# Altium project pca10156.PrjPCB
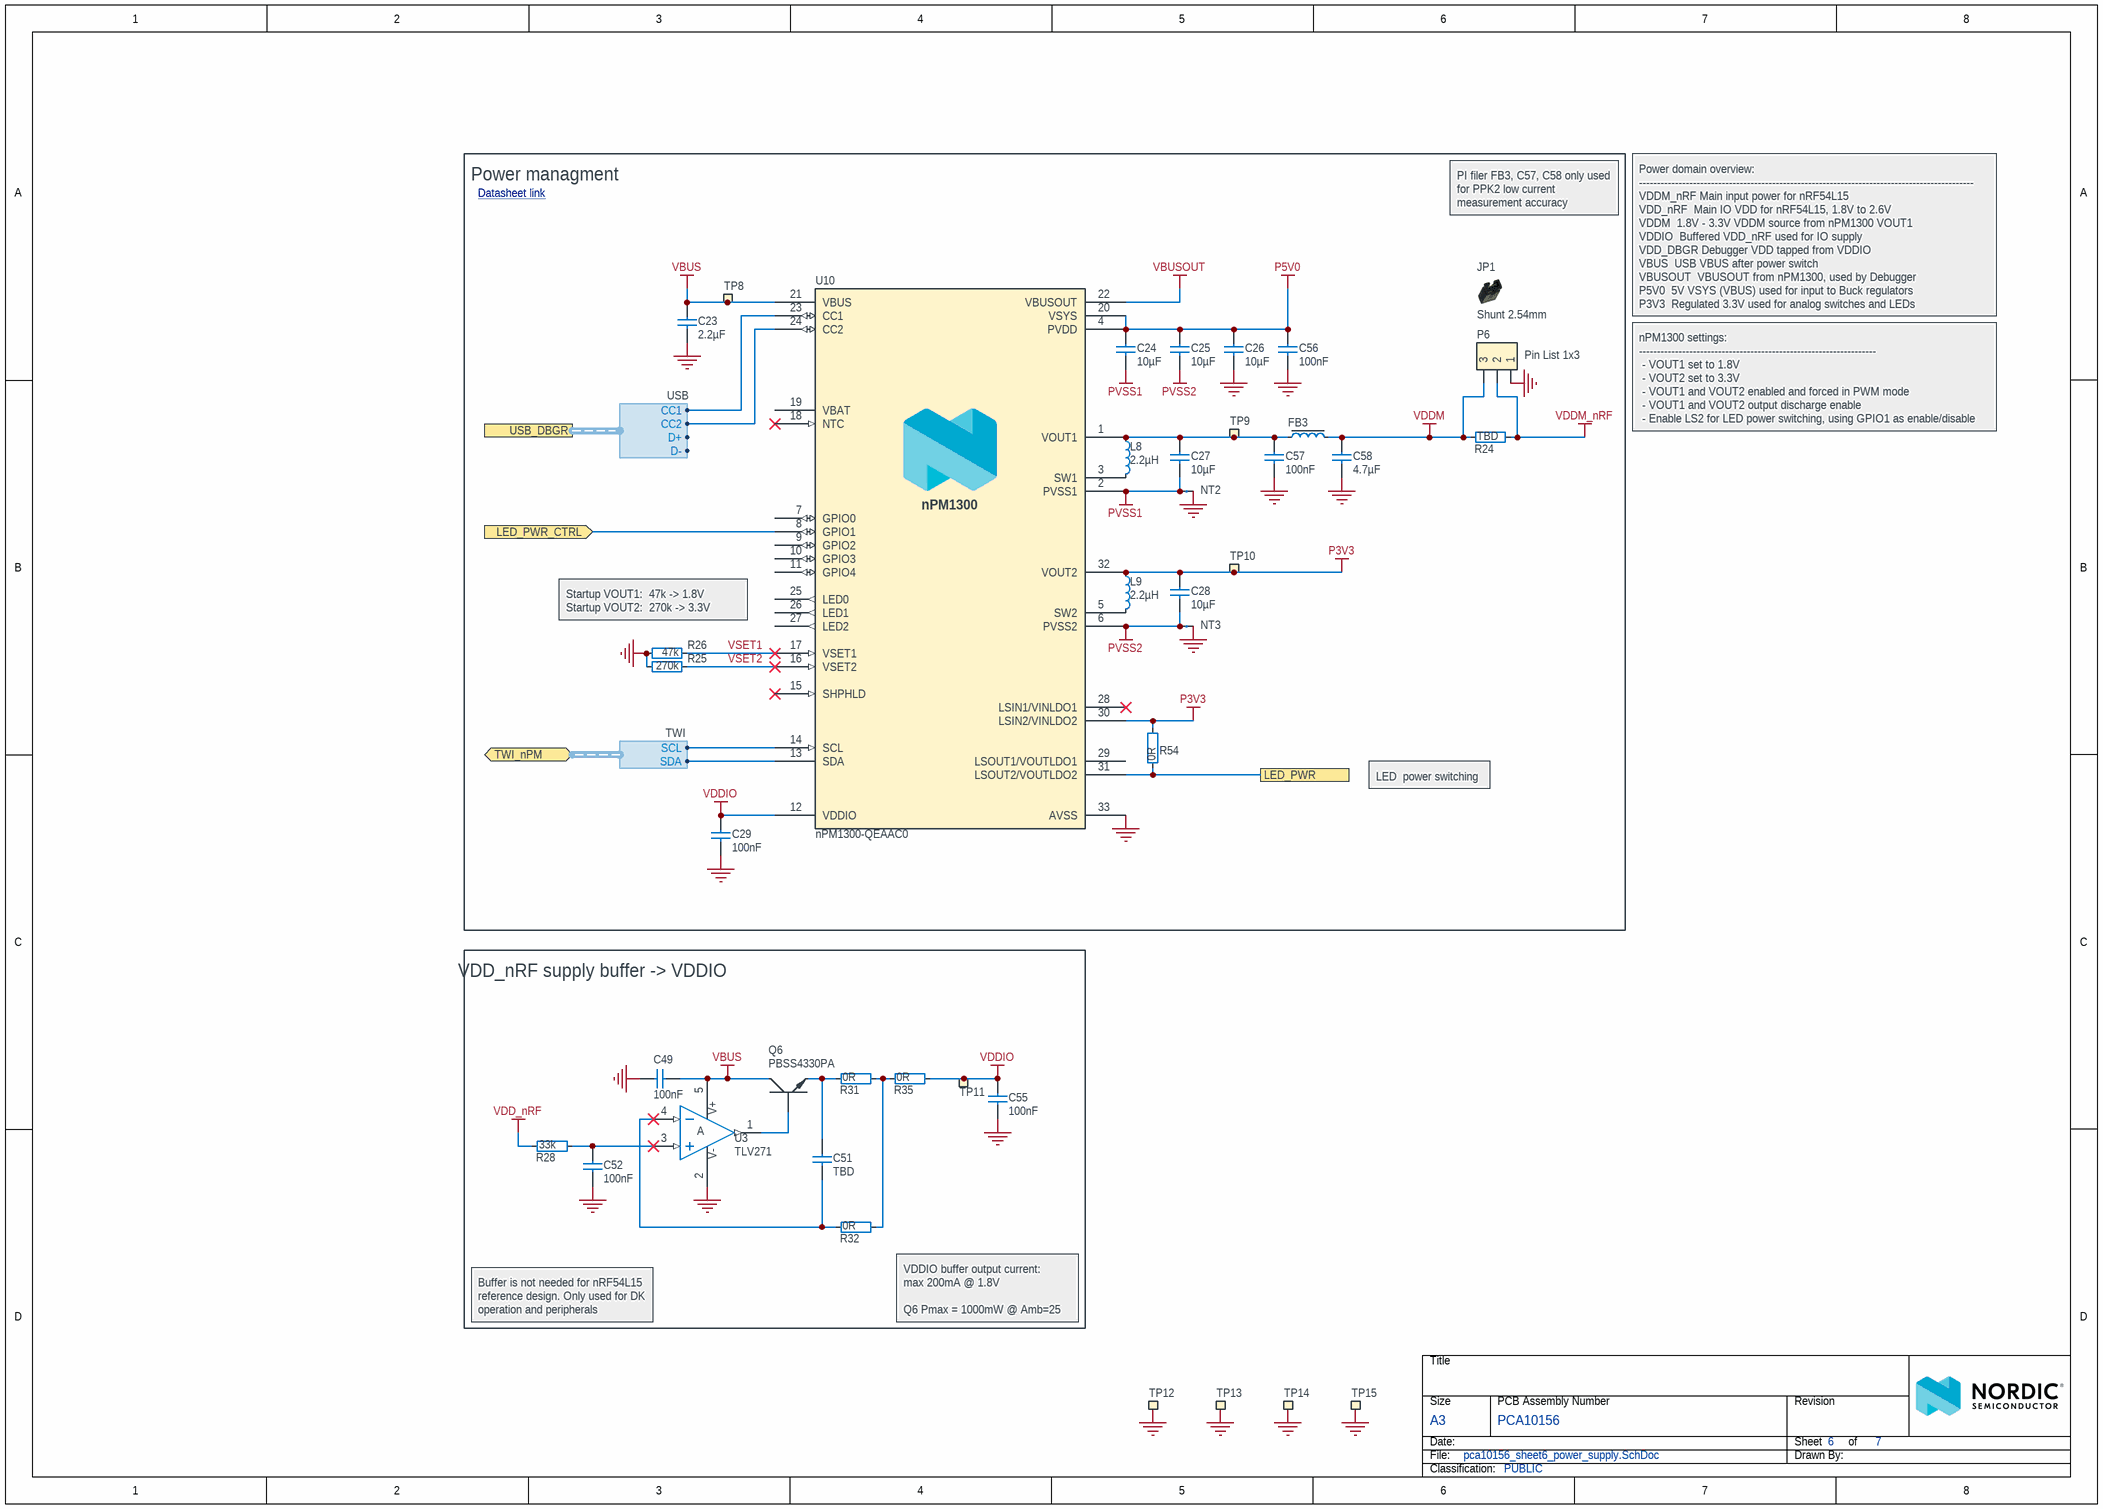
[diagram p0: pca10156_sheet6_power_supply.SchDoc]
SurfaceFinish: ENIG Gold; SoldermaskColor: Blue; SilkscreenColor: White; ProductName: nRF54L15-DK; PCBStackup: 4001; PCBRevision: 0032STL1; PCBNumber: 400708; PCARevision: 0.9.1; PCAName: PCA10156; Organization: Nordic Semiconductor; NrOfLayers: 4; Dielectric: FR-4; Designer: STL1; Compliance: RoHS, REACH, Halogen-Free; Classification: PUBLIC; BoardTitle: nRF54L15-DK; BoardThickness: 1.6mm
2 sheets, 65 parts. Net scope: flat (ports and power ports of the same name join across sheets).
Board files: 400708.PcbDoc, 400708 _panel.PcbDoc
Sheets:
  pca10156_sheet6_power_supply.SchDoc
  pca10156_sheet7_connectors.SchDoc

## Sheet pca10156_sheet6_power_supply.SchDoc: =BoardTitle+' - Power Supply'
size A3; Organization: Nordic Semiconductor; DocumentNumber: 6; Revision: 0.9.1; SheetNumber: 6; SheetTotal: 7; Author: STL1; CompanyName: Nordic Semiconductor; DrawnBy: STL1; DocumentSize: A4

### Parts
C23  2.2µF  [CAPC1005X04L]
C24  10µF  [CAPC1608X06L]
C25  10µF  [CAPC1608X06L]
C26  10µF  [CAPC1608X06L]
C27  10µF  [CAPC1608X06L]
C28  10µF  [CAPC1608X06L]
C29  100nF  [CAPC0603X03L_C]
C49  100nF  [CAPC0603X03L_C]
C51  TBD  [CAPC0603X03L_C]
C52  100nF  [CAPC0603X03L_C]
C55  100nF  [CAPC0603X03L_C]
C56  100nF  [CAPC0603X03L_C]
C57  100nF  [CAPC0603X03L_C]
C58  4.7µF  [CAPC1608X06L]
FB3  120R/0.55A  [INDC1005X04L]  (value not drawn)
JP1  Shunt 2.54mm  [Shunt_2.54mm_Vertical]
L8  2.2µH  [INDC2016X10N]
L9  2.2µH  [INDC2016X10N]
NT2  Net tie  [2 PIN STARPOINT]  (value not drawn)  (net tie, no BOM)
NT3  Net tie  [2 PIN STARPOINT]  (value not drawn)  (net tie, no BOM)
P6  Pin List 1x3  [LIST_1x3_SMD]
Q6  PBSS4330PA  [DFN105P200X65-3N_v2]
R24  TBD  [RESC1005X04L]
R25  270k  [RESC0603X03L_C]
R26  47k  [RESC0603X03L_C]
R28  33k  [RESC0603X03L_C]
R31  0R  [RESC0603X03L_C]
R32  0R  [RESC0603X03L_C]
R35  0R  [RESC0603X03L_C]
R54  0R  [RESC0603X03L_C]
TP8  Ø1.5mm,SMD  [TP_SMD_D1.5mm]  (value not drawn)  (no BOM)
TP9  Ø1.5mm,SMD  [TP_SMD_D1.5mm]  (value not drawn)  (no BOM)
TP10  Ø1.5mm,SMD  [TP_SMD_D1.5mm]  (value not drawn)  (no BOM)
TP11  Ø1.5mm,SMD  [TP_SMD_D1.5mm]  (value not drawn)  (no BOM)
TP12  Ø1.5mm,SMD  [TP_SMD_D1.5mm]  (value not drawn)  (no BOM)
TP13  Ø1.5mm,SMD  [TP_SMD_D1.5mm]  (value not drawn)  (no BOM)
TP14  Ø1.5mm,SMD  [TP_SMD_D1.5mm]  (value not drawn)  (no BOM)
TP15  Ø1.5mm,SMD  [TP_SMD_D1.5mm]  (value not drawn)  (no BOM)
U3  TLV271  [SOT95P280X145-5N]
U10  nPM1300-QEAAC0  [Nordic_QFN50P500X500X90-33N]

### Blocks framed on the sheet
Power managment: C23-C29 C56-C58 FB3 JP1 L8 L9 NT2 NT3 P6 R24-R26 R54 TP8-TP10 U10
VDD_nRF supply buffer -> VDDIO: C49 C51 C52 C55 Q6 R28 R31 R32 R35 TP11 U3

### Ports
LED_PWR, LED_PWR_CTRL (in), TWI_nPM (bidir, harness TWI), USB_DBGR (harness USB)

### Harnesses
TWI: SDA, SCL
USB: D+, D-, CC1, CC2

### Nets
GND: C23.1 C26.1 C29.2 C49.2 C52.2 C55.2 C56.1 C57.1 C58.2 NT2.1 NT3.1 P6.1 R25.2 R26.2 TP12.1 TP13.1 TP14.1 TP15.1 U3.2(VSS) U10.33(AVSS)
P3V3: C28.2 L9.1 R54.2 TP10.1 U10.30(LSIN2/VINLDO2) U10.32(VOUT2)
P5V0: C24.2 C25.2 C26.2 C56.2 U10.4(PVDD) U10.20(VSYS)
PVSS1: C24.1 C27.1 NT2.2 U10.2(PVSS1)
PVSS2: C25.1 C28.1 NT3.2 U10.6(PVSS2)
VBUS: C23.2 C49.1 Q6.3(C) TP8.1 U3.5(VDD) U10.21(VBUS)
VBUSOUT: U10.22(VBUSOUT)
VDD_nRF: R28.1
VDDIO: C29.1 C55.1 R35.2 TP11.1 U10.12(VDDIO)
VDDM: C58.1 FB3.2 P6.3 R24.2
VDDM_nRF: P6.2 R24.1
VSET1: R26.1 U10.17(VSET1)
VSET2: R25.1 U10.16(VSET2)
NetC27_2: C27.2 C57.2 FB3.1 L8.1 TP9.1 U10.1(VOUT1)
NetC51_1: C51.1 R32.1 U3.4(IN-)
NetC51_2: C51.2 Q6.2(E) R31.1
NetC52_1: C52.1 R28.2 U3.3(IN+)
NetJ3_A5: U10.23(CC1) ; port USB_DBGR.CC1
NetJ3_B5: U10.24(CC2) ; port USB_DBGR.CC2
NetL8_2: L8.2 U10.3(SW1)
NetL9_2: L9.2 U10.5(SW2)
NetQ6_1: Q6.1(B) U3.1(OUT)
NetR31_2: R31.2 R32.2 R35.1
NetR54_1: R54.1 U10.31(LSOUT2/VOUTLDO2) ; port LED_PWR
NetU10_8: U10.8(GPIO1) ; port LED_PWR_CTRL
NetU10_13: U10.13(SDA) ; port TWI_nPM.SDA
NetU10_14: U10.14(SCL) ; port TWI_nPM.SCL

Not connected (* = marked no-connect by the designer): U10 7(GPIO0) 9(GPIO2) 10(GPIO3) 11(GPIO4) 15(SHPHLD)* 18(NTC)* 19(VBAT) 25(LED0) 26(LED1) 27(LED2) 28(LSIN1/VINLDO1)* 29(LSOUT1/VOUTLDO1)

### Notes on the sheet
- Datasheet link <https://infocenter.nordicsemi.com/index.jsp?topic=%2Fstruct_pmic%2Fstruct%2Fnpm1300.html>
- PI filer FB3, C57, C58 only used for PPK2 low current measurement accuracy
- Power domain overview:
  ---------------------------------------------------------------------------------------------
  VDDM_nRF	Main input power for nRF54L15
  VDD_nRF		Main IO VDD for nRF54L15, 1.8V to 2.6V
  VDDM		1.8V - 3.3V VDDM source from nPM1300 VOUT1
  VDDIO		Buffered VDD_nRF used for IO supply
  VDD_DBGR	Debugger VDD tapped from VDDIO
  VBUS		USB VBUS after power switch
  VBUSOUT		VBUSOUT from nPM1300, used by Debugger
  P5V0		5V VSYS (VBUS) used for input to Buck regulators
  P3V3		Regulated 3.3V used for analog switches and LEDs
- nPM1300 settings:
  ------------------------------------------------------------------
  - VOUT1 set to 1.8V
  - VOUT2 set to 3.3V
  - VOUT1 and VOUT2 enabled and forced in PWM mode
  - VOUT1 and VOUT2 output discharge enable
  - Enable LS2 for LED power switching, using GPIO1 as enable/disable signal.
- Startup VOUT1:  47k -> 1.8V
  Startup VOUT2:  270k -> 3.3V
- LED  power switching
- Buffer is not needed for nRF54L15 reference design. Only used for DK operation and peripherals
- (near R32) VDDIO buffer output current:
  max 200mA @ 1.8V
  Q6 Pmax = 1000mW @ Amb=25
- Title
- Size
- Date:
- File:
- A3
- PCB Assembly Number
- Sheet
- Drawn By:
- Revision
- of
- Classification:
- (in symbol nPM1300-QEAAC0) nPM1300
- (in symbol TLV271CW5-7) V+; A; V-

### Library data of the parts
C23 = C0402-2µ2-10V: Capacitor, X5R, ±10%; Manufacturer: N.A.; Part number NEMS: 100200376; Component Status: Active; Pad Count: 2; Note: 10V; Part Number: C0402-2µ2-10V; PartId: 100200376; Component Class: Capacitors; Author: rsk; Manufacturer Part Number: N.A.; ComponentLink1URL: N.A.; ComponentLink1Description: Datasheet; ComponentLink2URL: N.A.; ComponentLink2Description: Supplier link; HelpURL: N.A.; LatestRevisionDate: 2020-10-13; Published: 2016-08-22; Footprint Doc: 0402; Value: 2.2µF; Supplier 1: Digi-Key; Supplier Part Number 1: 490-10451-1-ND; Supplier 2: N.A.; Supplier Part Number 2: N.A.; Artikkelnr Noca: N.A.; Part number IPS: N.A.; Part number Norautron: N.A.
C24-C28 = C0603-10µ-10V-X7T-GRM188D71A106MA73: Capacitor, X7T, ±20%, 10V; Manufacturer: Murata; Part number IPS: 00000004696; Part number NEMS: 100200414; Component Status: Active; Pad Count: 2; Note: 10VDC; Artikkelnr Noca: N.A.; Part Number: C0603-10µ-10V-X7T-GRM188D71A106MA73; PartId: 100200414; Component Class: Capacitors; Author: rsk; Manufacturer Part Number: GRM188D71A106MA73; ComponentLink1URL: N.A.; ComponentLink1Description: Datasheet; ComponentLink2URL: N.A.; ComponentLink2Description: Supplier link; HelpURL: https://no.mouser.com/datasheet/2/281/murata_03052018_GRM_Series_1-1310166.pdf; LatestRevisionDate: 2021-07-22; Published: 2018-09-11; Footprint Doc: 0603; Value: 10µF; Supplier 1: Digi-Key; Supplier Part Number 1: 490-7200-1-ND; Supplier 2: Mouser; Supplier Part Number 2: 81-GRM188D71A106MA3D; Part number Norautron: N.A.
C29 C49 C52 C55 = C0201-100n: Capacitor, X5R, ±10%; Manufacturer: N.A.; Part number IPS: 00000001248, 00000002505; Part number Norautron: 262071862; Part number NEMS: 100200078; Pad Count: 2; Note: 16V; Component Status: Active; Part Number: C0201-100n; Value: 100nF; Footprint Doc: 0201; Component Class: Capacitors; Author: rsk; PartId: 100200078; Manufacturer Part Number: N.A.; ComponentLink1URL: N.A.; ComponentLink1Description: Datasheet; ComponentLink2URL: N.A.; ComponentLink2Description: Supplier link; HelpURL: N.A.; LatestRevisionDate: 2017-11-09; Published: 2014-11-13; Supplier 1: N.A.; Supplier Part Number 1: N.A.; Supplier 2: N.A.; Supplier Part Number 2: N.A.; Artikkelnr Noca: N.A.
C51 = C0201-TBD: Chip Cap 0201; Manufacturer: N.A.; Part number NEMS: 100200002; Component Status: Active; Pad Count: 2; Assembly: Not Mounted; Part Number: C0201-TBD; PartId: 100200002; Component Class: Capacitors; Author: rsk; Manufacturer Part Number: N.A.; ComponentLink1URL: N.A.; ComponentLink1Description: Datasheet; ComponentLink2URL: N.A.; ComponentLink2Description: Supplier link; HelpURL: N.A.; LatestRevisionDate: 2014-11-13; Published: 2014-11-13; Footprint Doc: 0201; Value: TBD; Note: Chip Cap; Supplier 1: N.A.; Supplier Part Number 1: N.A.; Supplier 2: N.A.; Supplier Part Number 2: N.A.; Artikkelnr Noca: N.A.; Part number IPS: N.A.; Part number Norautron: N.A.
C56 = C0201-100n: Capacitor, X5R, ±10%; Manufacturer: N.A.; Part number IPS: 00000001248, 00000002505; Part number Norautron: 262071862; Part number NEMS: 100200078; Note: 16V; Assembly: Not Mounted; Pad Count: 2; Component Status: Active; Part Number: C0201-100n; Manufacturer Part Number: N.A.; LatestRevisionDate: 2017-11-09; Published: 2014-11-13; Value: 100nF; Artikkelnr Noca: N.A.; Footprint Doc: 0201; ComponentLink1URL: N.A.; ComponentLink1Description: Datasheet; ComponentLink2URL: N.A.; ComponentLink2Description: Supplier link; HelpURL: N.A.; Supplier 1: N.A.; Supplier Part Number 1: N.A.; Supplier 2: N.A.; Supplier Part Number 2: N.A.; Component Class: Capacitors; PartId: 100200078; Author: rsk
C57 = C0201-100n: Capacitor, X5R, ±10%; Manufacturer: N.A.; Part number IPS: 00000001248, 00000002505; Part number Norautron: 262071862; Part number NEMS: 100200078; Note: 16V; Pad Count: 2; Component Status: Active; Part Number: C0201-100n; Manufacturer Part Number: N.A.; LatestRevisionDate: 2017-11-09; Published: 2014-11-13; Value: 100nF; Artikkelnr Noca: N.A.; Footprint Doc: 0201; ComponentLink1URL: N.A.; ComponentLink1Description: Datasheet; ComponentLink2URL: N.A.; ComponentLink2Description: Supplier link; HelpURL: N.A.; Supplier 1: N.A.; Supplier Part Number 1: N.A.; Supplier 2: N.A.; Supplier Part Number 2: N.A.; Component Class: Capacitors; PartId: 100200078; Author: rsk
C58 = C0603-4µ7-10V-X7S: Capacitor, X7S, ±10%, 10V; Manufacturer: N.A.; Part number IPS: 00000001779; Part number NEMS: 100200351; Pad Count: 2; Artikkelnr Noca: 20030013; Component Status: Active; Part Number: C0603-4µ7-10V-X7S; Value: 4.7µF; Footprint Doc: 0603; Component Class: Capacitors; Author: rsk; PartId: 100200351; Manufacturer Part Number: N.A.; ComponentLink1URL: N.A.; ComponentLink1Description: Datasheet; ComponentLink2URL: N.A.; ComponentLink2Description: Supplier link; HelpURL: N.A.; LatestRevisionDate: 2016-08-15; Published: 2016-08-15; Note: 10V; Supplier 1: Digi-Key; Supplier Part Number 1: 445-14258-1-ND; Supplier 2: N.A.; Supplier Part Number 2: N.A.; Part number Norautron: N.A.
FB3 = FB0402-120R@100M-500mA: Ferrite Bead, 120 Ohm @ 100MHz, 500mA, 250 mOhm Max; Manufacturer: Murata; Manufacturer Part Number: BLM15AG121SN1D; Part number IPS: 00000009954; Part number Norautron: 265230631; Part number NEMS: 100300099; Note: Chip EMIFIL Inductor Type Chip Ferrite Bead; Artikkelnr Noca: 33029317; Pad Count: 2; Component Status: Active; Part Number: FB0402-120R@100M-500mA; Footprint Doc: 0402; LatestRevisionDate: 2014-01-10; Published: 2011-11-14; Value: 120R/0.55A; ComponentLink1Description: Datasheet; ComponentLink2Description: Supplier link; ComponentLink1URL: N.A.; ComponentLink2URL: N.A.; HelpURL: http://search.murata.co.jp/Ceramy/image/img/PDF/ENG/L0110S0100BLM15A_SN.pdf; Supplier 1: Digi-Key; Supplier Part Number 1: 490-1005-1-ND; Supplier 2: Farnell; Supplier Part Number 2: 151-5760; Component Class: Inductors; PartId: 100300099; Author: rsk
JP1 = SHUNT JUMPER 2.54mm Black Vertical: Shunt Jumper 2.54mm Black, open top; Manufacturer: WCON; Manufacturer Part Number: 3710-6001OS0B05; Part number NEMS: 100500728; Pad Count: 2; Note: N.A.; Component Status: Active; System: Connector; Part Number: SHUNT JUMPER 2.54mm Black Vertical; PartId: 100500752; Component Class: Connectors; Author: masi; ComponentLink1URL: N.A.; ComponentLink1Description: Datasheet; ComponentLink2URL: N.A.; ComponentLink2Description: Supplier link; HelpURL: N.A.; Footprint Doc: SHUNT JUMPER 2.54mm; LatestRevisionDate: 2024-08-02; Published: 2022-07-01; Value: Shunt 2.54mm; Supplier 1: Cabcon; Supplier Part Number 1: 3710-6001OS0B05; Supplier 2: N.A.; Supplier Part Number 2: N.A.; Artikkelnr Noca: N.A.; Part number IPS: N.A.; Part number Norautron: N.A.
L8 L9 = L0806-2µ2-2500mA-73mOhm-CIGT201610EH2R2MNE: Inductor, Irms=2.5A, Isat=2.9A, ±20%, DCR=73mΩ; Manufacturer: Samsung Electro-Mechanics America; Part number Norautron: 26521789; Part number NEMS: 100300400; Component Status: Active; Pad Count: 2; Note: Unshielded Thin Film Inductor; Artikkelnr Noca: N.A.; Part Number: L0806-2µ2-2500mA-73mOhm-CIGT201610EH2R2MNE; PartId: 100300400; Component Class: Inductors; Author: rsk; Manufacturer Part Number: CIGT201610EH2R2MNE; ComponentLink1URL: https://media.digikey.com/pdf/Data%20Sheets/Samsung%20PDFs/CIGT201610EH2R2MNE_Spec.pdf; ComponentLink1Description: Datasheet; ComponentLink2URL: https://www.digikey.com/en/products/detail/samsung-electro-mechanics/CIGT201610EH2R2MNE/7041223?s=N4IgTCBcDaIMIEkDiAVMAGAjANk%2BgogBJgBKYAsgHL4gC6AvkA; ComponentLink2Description: Supplier link; HelpURL: http://product.samsungsem.com/pi/CIGT201610EH2R2MN.do; LatestRevisionDate: 2022-09-07; Published: 2021-02-03; Footprint Doc: 0806; Value: 2.2µH; Supplier 1: Digi-Key; Supplier Part Number 1: 1276-6901-1-ND; Supplier 2: Mouser; Supplier Part Number 2: 187-CIGT201610EH2R2M; Part number IPS: N.A.
NT2 NT3 = 2 pin starpoint: Starpoint; Manufacturer: N.A.; Part number NEMS: 100500603; Pad Count: 2; Component Status: Active; System: Connector; Part Number: 2 pin starpoint; Manufacturer Part Number: N.A.; ComponentLink1URL: N.A.; ComponentLink1Description: Datasheet; ComponentLink2URL: N.A.; ComponentLink2Description: Supplier link; HelpURL: N.A.; Footprint Doc: N.A.; LatestRevisionDate: 2017-08-31; Published: 2017-08-31; Value: Net tie; Note: Net tie; Supplier 1: N.A.; Supplier Part Number 1: N.A.; Supplier 2: N.A.; Supplier Part Number 2: N.A.; Artikkelnr Noca: N.A.; Part number IPS: N.A.; Component Class: Connectors; PartId: 100500603; Author: rsk; Part number Norautron: N.A.
P6 = Pin List 1x3 SMD: Pin List 1x3, 2.54mm (100mil), SMD; Manufacturer: WCON; Manufacturer Part Number: 1125-1103S0M116CR04; Part number Norautron: 26470016; Part number NEMS: 100500306; Note: N.A.; Pad Count: 3; Component Status: Active; System: Connector; Part Number: Pin List 1x3 SMD; Footprint Doc: LIST_1x3_SMD; LatestRevisionDate: 2021-09-24; Published: 2013-10-21; Value: Pin List 1x3; Artikkelnr Noca: N.A.; ComponentLink1URL: N.A.; ComponentLink1Description: Datasheet; ComponentLink2URL: N.A.; ComponentLink2Description: Supplier link; HelpURL: N.A.; Part number IPS: N.A.; Supplier 1: Cabcon; Supplier Part Number 1: 1125-1103S0M116CR04; Supplier 2: Samtec; Supplier Part Number 2: TSM-103-01-L-SV-P-TR; Component Class: Connectors; PartId: 100500306; Author: rsk
Q6 = PBSS4330PA,115: 30V, 3A, 2.1W, G=270, NPN Transistor; Manufacturer: Nexperia; Part number NEMS: 101300184; Component Status: Active; Pad Count: 3; Note: N.A.; Part Number: PBSS4330PA,115; PartId: 101300184; Component Class: Semiconductors; Author: rubr; Manufacturer Part Number: PBSS4330PA,115; ComponentLink1URL: https://assets.nexperia.com/documents/data-sheet/PBSS4330PA.pdf; ComponentLink1Description: Datasheet; ComponentLink2URL: https://www.digikey.com/en/products/detail/nexperia-usa-inc/PBSS4330PA-115/2296330; ComponentLink2Description: Supplier link; HelpURL: https://www.nexperia.com/products/bipolar-transistors/general-purpose-and-low-vcesat-bipolar-transistors/single-bipolar-transistors/single-bipolar-transistors-100-v/PBSS4330PA.html; LatestRevisionDate: 2021-06-03; Published: 2021-06-03; Footprint Doc: HUSON-3 (2x2); Value: PBSS4330PA; Supplier 1: Digi-Key; Supplier Part Number 1: 1727-5112-1-ND‎; Supplier 2: N.A.; Supplier Part Number 2: N.A.; Artikkelnr Noca: N.A.; Part number IPS: N.A.; Part number Norautron: N.A.
R24 = R0402-TBD: Chip Res 0402; Manufacturer: N.A.; Part number NEMS: 100100282; Component Status: Active; Pad Count: 2; Assembly: Not Mounted; Part Number: R0402-TBD; PartId: 100100282; Component Class: Resistors; Author: rsk; Manufacturer Part Number: N.A.; ComponentLink1URL: N.A.; ComponentLink1Description: Datasheet; ComponentLink2URL: N.A.; ComponentLink2Description: Supplier link; HelpURL: N.A.; LatestRevisionDate: 2010-12-21; Published: 2010-12-21; Footprint Doc: 0402; Value: TBD; Note: Chip Res; Supplier 1: N.A.; Supplier Part Number 1: N.A.; Supplier 2: N.A.; Supplier Part Number 2: N.A.; Artikkelnr Noca: N.A.; Part number IPS: N.A.; Part number Norautron: N.A.
R25 = R0201-270k: Resistor, ±1%, 0.05W; Manufacturer: N.A.; Part number IPS: 00000004317; Part number NEMS: 100100086; Component Status: Active; Pad Count: 2; Note: Chip Res 1%; Part Number: R0201-270k; PartId: 100100086; Component Class: Resistors; Author: rsk; Manufacturer Part Number: N.A.; ComponentLink1URL: N.A.; ComponentLink1Description: Datasheet; ComponentLink2URL: N.A.; ComponentLink2Description: Supplier link; HelpURL: N.A.; LatestRevisionDate: 2014-11-13; Published: 2014-11-13; Footprint Doc: 0201; Value: 270k; Supplier 1: N.A.; Supplier Part Number 1: N.A.; Supplier 2: N.A.; Supplier Part Number 2: N.A.; Artikkelnr Noca: N.A.; Part number Norautron: N.A.
R26 = R0201-47k: Resistor, ±1%, 0.05W; Manufacturer: N.A.; Part number IPS: 00000001423; Part number NEMS: 100100076; Component Status: Active; Pad Count: 2; Note: Chip Res 1%; Part Number: R0201-47k; PartId: 100100076; Component Class: Resistors; Author: rsk; Manufacturer Part Number: N.A.; ComponentLink1URL: N.A.; ComponentLink1Description: Datasheet; ComponentLink2URL: N.A.; ComponentLink2Description: Supplier link; HelpURL: N.A.; LatestRevisionDate: 2014-11-13; Published: 2014-11-13; Footprint Doc: 0201; Value: 47k; Supplier 1: N.A.; Supplier Part Number 1: N.A.; Supplier 2: N.A.; Supplier Part Number 2: N.A.; Artikkelnr Noca: N.A.; Part number Norautron: N.A.
R28 = R0201-33k: Resistor, ±1%, 0.05W; Manufacturer: N.A.; Part number IPS: 00000001708; Part number NEMS: 100100073; Component Status: Active; Pad Count: 2; Note: Chip Res 1%; Part Number: R0201-33k; PartId: 100100073; Component Class: Resistors; Author: rsk; Manufacturer Part Number: N.A.; ComponentLink1URL: N.A.; ComponentLink1Description: Datasheet; ComponentLink2URL: N.A.; ComponentLink2Description: Supplier link; HelpURL: N.A.; LatestRevisionDate: 2014-11-13; Published: 2014-11-13; Footprint Doc: 0201; Value: 33k; Supplier 1: N.A.; Supplier Part Number 1: N.A.; Supplier 2: N.A.; Supplier Part Number 2: N.A.; Artikkelnr Noca: N.A.; Part number Norautron: N.A.
R31 R32 R35 = R0201-0R: Resistor, ±5%, 0.05W; Manufacturer: N.A.; Part number IPS: 00000003245; Part number NEMS: 100100001; Component Status: Active; Pad Count: 2; Note: Chip Res 5%; Part Number: R0201-0R; PartId: 100100001; Component Class: Resistors; Author: rsk; Manufacturer Part Number: N.A.; ComponentLink1URL: N.A.; ComponentLink1Description: Datasheet; ComponentLink2URL: N.A.; ComponentLink2Description: Supplier link; HelpURL: N.A.; LatestRevisionDate: 2017-11-09; Published: 2014-11-13; Footprint Doc: 0201; Value: 0R; Supplier 1: N.A.; Supplier Part Number 1: N.A.; Supplier 2: N.A.; Supplier Part Number 2: N.A.; Artikkelnr Noca: N.A.; Part number Norautron: N.A.
R54 = R0201-0R: Resistor, ±5%, 0.05W; Manufacturer: N.A.; Part number IPS: 00000003245; Part number NEMS: 100100001; Component Status: Active; Pad Count: 2; Note: Chip Res 5%; Assembly: Not Mounted; Part Number: R0201-0R; PartId: 100100001; Component Class: Resistors; Author: rsk; Manufacturer Part Number: N.A.; ComponentLink1URL: N.A.; ComponentLink1Description: Datasheet; ComponentLink2URL: N.A.; ComponentLink2Description: Supplier link; HelpURL: N.A.; LatestRevisionDate: 2017-11-09; Published: 2014-11-13; Footprint Doc: 0201; Value: 0R; Supplier 1: N.A.; Supplier Part Number 1: N.A.; Supplier 2: N.A.; Supplier Part Number 2: N.A.; Artikkelnr Noca: N.A.; Part number Norautron: N.A.
TP8-TP15 = TP_SMD_Ø1.5MM: 1.5mm circular SMD testpad; Manufacturer: Nordic Semiconductor; Manufacturer Part Number: N.A.; Part number NEMS: 100500477; Pad Count: 1; Component Status: Active; Part Number: TP_SMD_Ø1.5MM; ComponentLink1URL: N.A.; ComponentLink1Description: Datasheet; ComponentLink2URL: N.A.; ComponentLink2Description: Supplier link; HelpURL: N.A.; Footprint Doc: TP_SMD_Ø1.5mm; LatestRevisionDate: 2021-03-05; Published: 2016-06-02; Value: Ø1.5mm,SMD; Note: N.A.; Supplier 1: N.A.; Supplier Part Number 1: N.A.; Supplier 2: N.A.; Supplier Part Number 2: N.A.; Artikkelnr Noca: N.A.; Part number IPS: N.A.; Component Class: Connectors; PartId: 100500477; Author: rsk; Part number Norautron: N.A.
U3 = TLV271CW5-7: Dual rail to rail CMOS Amplifier; Manufacturer: Diodes Incorporated; Part number NEMS: 101900398; Component Status: Active; Pad Count: 5; Note: N.A.; Part Number: TLV271CW5-7; PartId: 101900398; Component Class: Misc_ICs; Author: rsk; Manufacturer Part Number: TLV271CW5-7; ComponentLink1URL: N.A.; ComponentLink1Description: Datasheet; ComponentLink2URL: N.A.; ComponentLink2Description: Supplier link; HelpURL: http://www.diodes.com/_files/datasheets/TLV27x.pdf; LatestRevisionDate: 2016-04-05; Published: 2016-04-05; Footprint Doc: SOT-25; Value: TLV271; Supplier 1: Digi-Key; Supplier Part Number 1: TLV271CW5-7DICT-ND; Supplier 2: N.A.; Supplier Part Number 2: N.A.; Artikkelnr Noca: N.A.; Part number IPS: N.A.; Part number Norautron: N.A.
U10 = nPM1300-QEAAC0: Li-Ion/Li-Polymer USB-C battery charger with high efficiency buck regulators, LDOs or load switches, LED drivers, TWI and VBUSOUT; Manufacturer: Nordic Semiconductor; Part number NEMS: 102000306; Component Status: Active; Pad Count: 33; Note: Production version; Artikkelnr Noca: N.A.; Part Number: nPM1300-QEAAC0; PartId: 102000306; Component Class: Nordic_Devices; Author: eisk; Manufacturer Part Number: nPM1300-QEAAC0; ComponentLink1URL: N.A.; ComponentLink1Description: Datasheet; ComponentLink2URL: N.A.; ComponentLink2Description: Supplier link; HelpURL: N.A.; LatestRevisionDate: 2023-08-16; Published: 2023-08-16; Footprint Doc: QFN-32; Value: nPM1300-QEAAC0; Supplier 1: Nordic Semiconductor; Supplier Part Number 1: nPM1300-QEAAC0; Supplier 2: N.A.; Supplier Part Number 2: N.A.; Part number IPS: N.A.; Part number Norautron: N.A.

## Sheet pca10156_sheet7_connectors.SchDoc: =BoardTitle+' - Connectors'
size A3; Organization: Nordic Semiconductor; DocumentNumber: 7; Revision: 0.9.1; SheetNumber: 7; SheetTotal: 7; Author: STL1; CompanyName: Nordic Semiconductor; DrawnBy: STL1; DocumentSize: A4
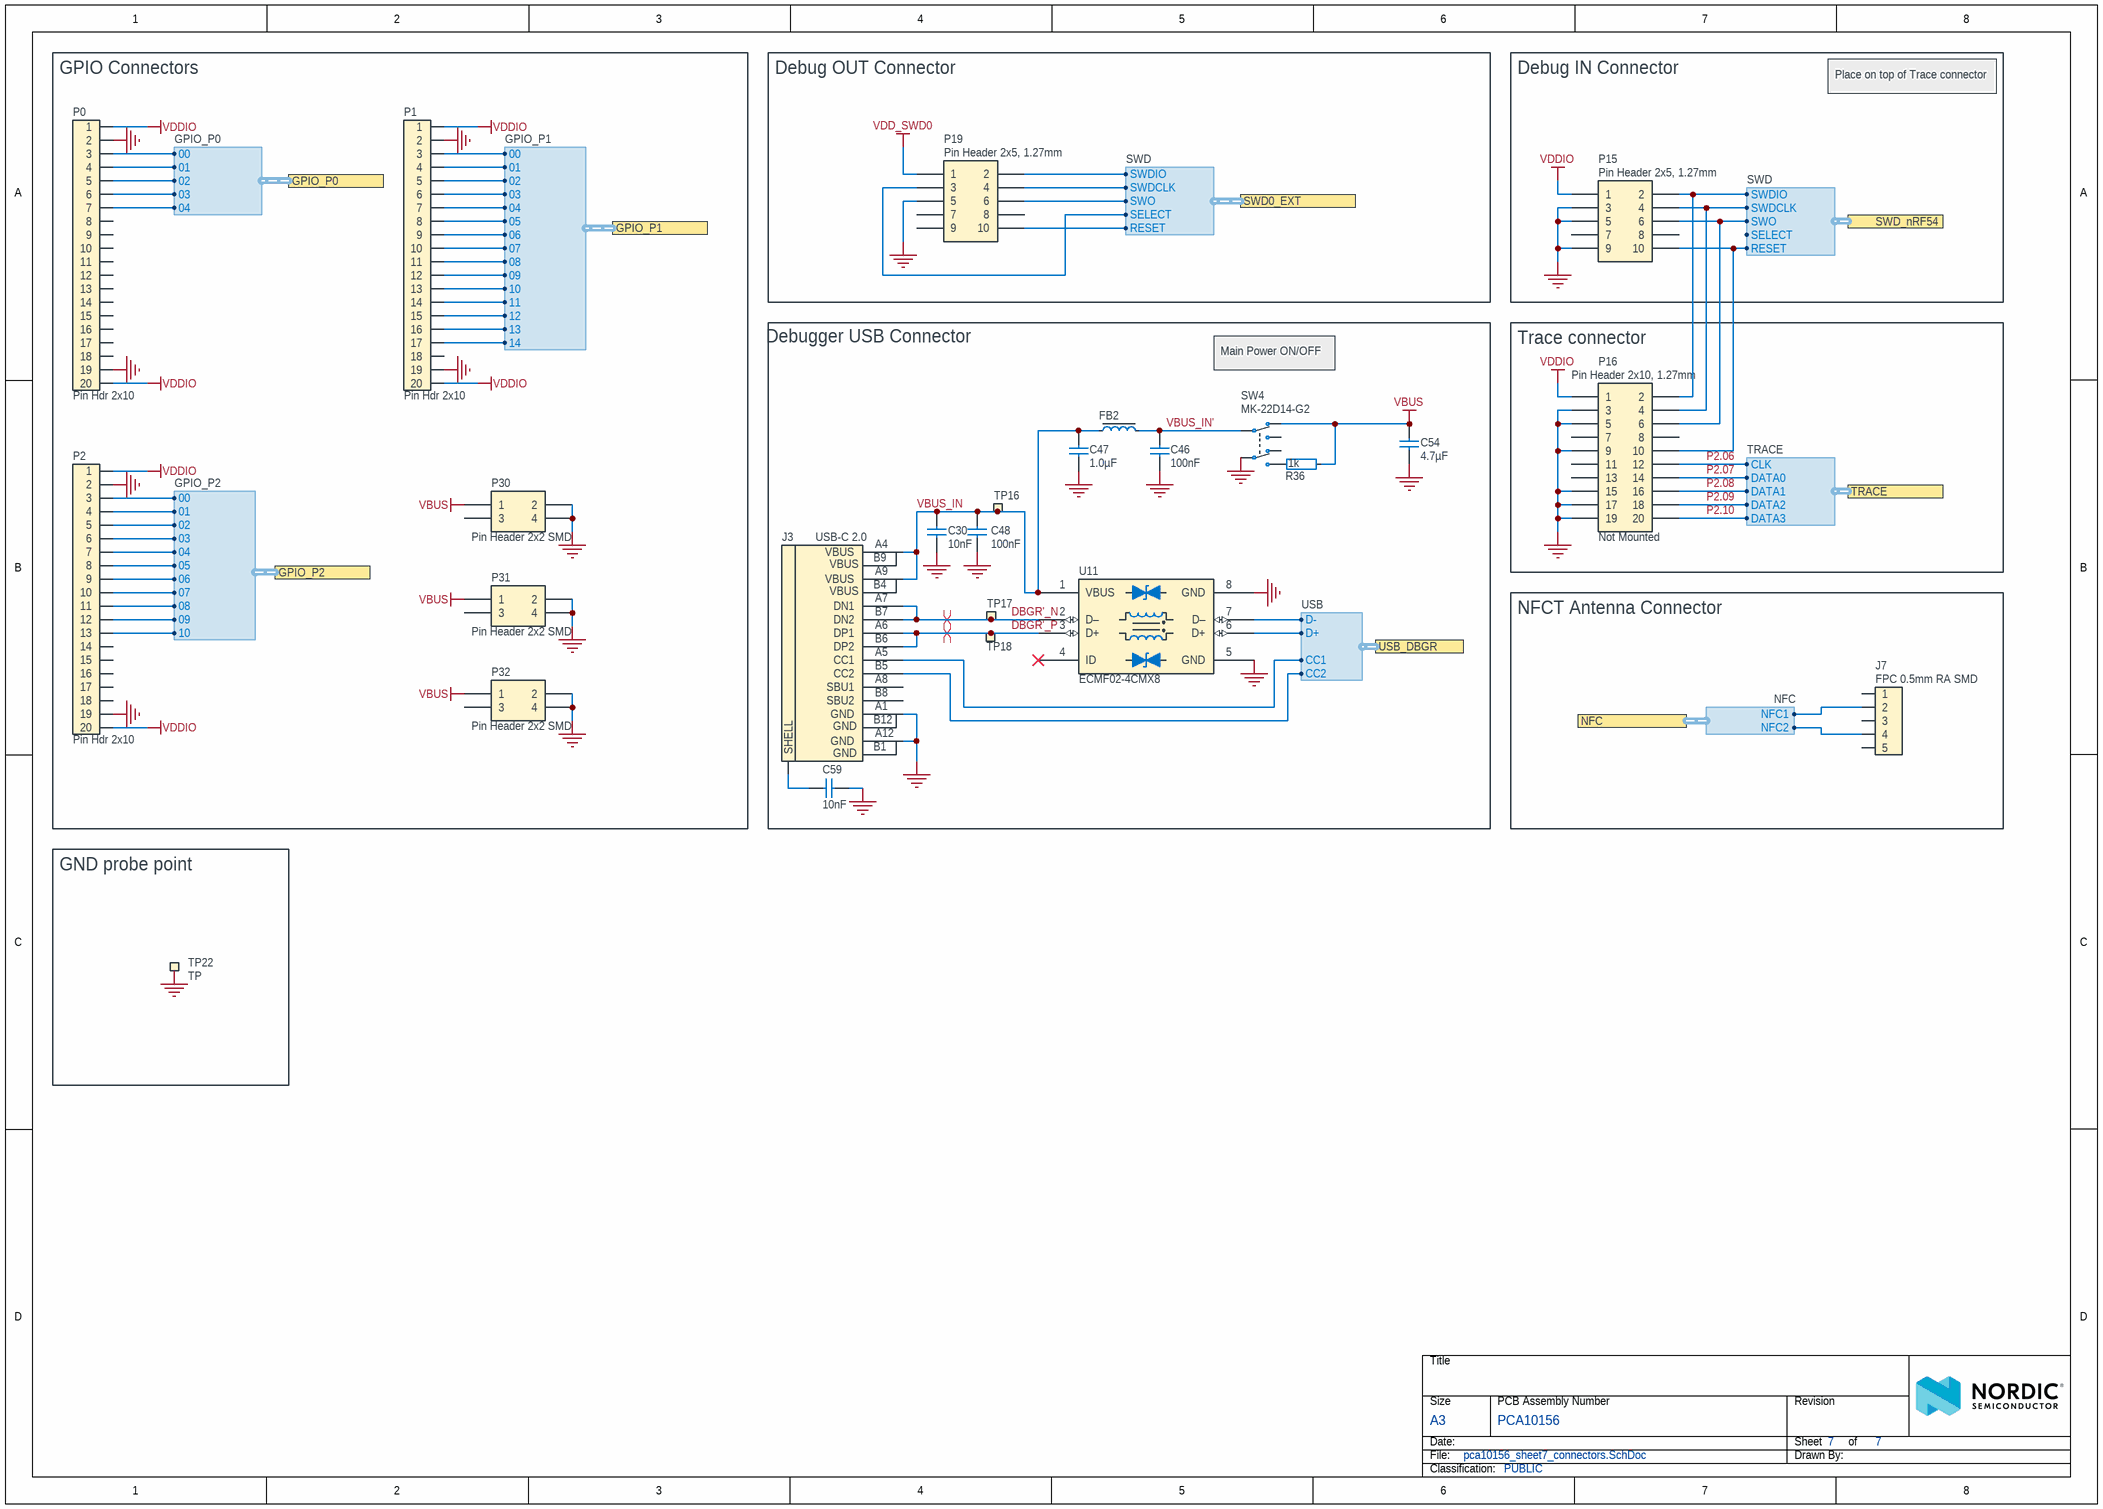
[diagram p1: pca10156_sheet7_connectors.SchDoc]

### Parts
C30  10nF  [CAPC0603X03L_C]
C46  100nF  [CAPC0603X03L_C]
C47  1.0µF  [CAPC1005X04L]
C48  100nF  [CAPC0603X03L_C]
C54  4.7µF  [CAPC1608X06L]
C59  10nF  [CAPC1608X06L]
FB2  120R/0.55A  [INDC1005X04L]  (value not drawn)
J3  USB-C 2.0  [SD-80259-001]
J7  FPC 0.5mm RA SMD  [FPC_05P-0.5mm-RA-SMD]
P0  Pin Hdr 2x10  [HDR_2x10-SMD]
P1  Pin Hdr 2x10  [HDR_2x10-SMD]
P2  Pin Hdr 2x10  [HDR_2x10-SMD]
P15  Pin Header 2x5, 1.27mm  [HDR_2x5-SMD-1.27mm-K]
P16  Pin Header 2x10, 1.27mm  Assembly: Not Mounted  [HDR_2x10-SMD-1.27mm-NC]
P19  Pin Header 2x5, 1.27mm  [HDR_2x5-SMD-1.27mm-K]
P30  Pin Header 2x2 SMD  [HDR_2x2-SMD]
P31  Pin Header 2x2 SMD  [HDR_2x2-SMD]
P32  Pin Header 2x2 SMD  [HDR_2x2-SMD]
R36  1k  [RESC0603X03L_C]
SW4  MK-22D14-G2  [MK-22D14-G2]
TP16  Ø1.5mm,SMD  [TP_SMD_D1.5mm]  (value not drawn)  (no BOM)
TP17  Ø1.5mm,SMD  [TP_SMD_D1.5mm]  (value not drawn)  (no BOM)
TP18  Ø1.5mm,SMD  [TP_SMD_D1.5mm]  (value not drawn)  (no BOM)
TP22  TP  [S1751]
U11  ECMF02-4CMX8  [UFDFN50P120X250X55-8N]

### Blocks framed on the sheet
GPIO Connectors: P0-P2 P30-P32
Debug OUT Connector: P19
Debug IN Connector: P15
Debugger USB Connector: C30 C46-C48 C54 C59 FB2 J3 R36 SW4 TP16-TP18 U11
Trace connector: P16
NFCT Antenna Connector: J7
GND probe point: TP22

### Ports
GPIO_P0 (harness GPIO_P0), GPIO_P1 (harness GPIO_P1), GPIO_P2 (harness GPIO_P2), NFC (harness NFC), SWD0_EXT (harness SWD), SWD_nRF54 (harness SWD), TRACE (harness TRACE), USB_DBGR (harness USB)

### Harnesses
USB: D+, D-, CC1, CC2
SWD: SWDIO, SWDCLK, SWO, RESET, SELECT
NFC: NFC2, NFC1
GPIO_P1: 00, 01, 02, 03, 04, 05, 06, 07, 08, 09, 10, 11, 12, 13, 14
GPIO_P2: 00, 01, 02, 03, 04, 05, 06, 07, 08, 09, 10
TRACE: CLK, DATA0, DATA1, DATA3, DATA2
GPIO_P0: 02, 03, 04, 00, 01

### Nets
GND: C30.2 C46.1 C47.1 C48.1 C54.2 C59.2 J3.A1(GND) J3.A12(GND) P0.2 P0.19 P1.2 P1.19 P2.2 P2.19 P15.3 P15.5 P15.9 P16.3 P16.5 P16.9 P16.15 P16.17 P16.19 P19.5 P30.2 P30.4 P31.2 P31.4 P32.2 P32.4 SW4.5(COM-2) TP22.1 U11.5(GND) U11.8(GND)
VBUS: C54.1 P30.1 P31.1 P32.1 R36.2 SW4.3(N.C-1)
VDD_SWD0: P19.1
VDDIO: P0.1 P0.20 P1.1 P1.20 P2.1 P2.20 P15.1 P16.1
DBGR'_N: J3.A7(DN1) J3.B7(DN2) TP17.1 U11.2(D–)
DBGR'_P: J3.A6(DP1) J3.B6(DP2) TP18.1 U11.3(D+)
P2.06: P16.12 ; port TRACE.CLK
P2.07: P16.14 ; port TRACE.DATA0
P2.08: P16.16 ; port TRACE.DATA1
P2.09: P16.18 ; port TRACE.DATA2
P2.10: P16.20 ; port TRACE.DATA3
VBUS_IN: C30.1 C47.2 C48.2 FB2.1 J3.A4(VBUS) J3.A9(VBUS) TP16.1 U11.1(VBUS)
VBUS_IN': C46.2 FB2.2 SW4.2(COM-1)
NetC59_1: C59.1 J3.SHLD(SHELL)
NetJ3_A5: J3.A5(CC1) ; port USB_DBGR.CC1
NetJ3_B5: J3.B5(CC2) ; port USB_DBGR.CC2
NetJ7_2: J7.2 ; port NFC.NFC1
NetJ7_4: J7.4 ; port NFC.NFC2
NetP0_3: P0.3 ; port GPIO_P0.00
NetP0_4: P0.4 ; port GPIO_P0.01
NetP0_5: P0.5 ; port GPIO_P0.02
NetP0_6: P0.6 ; port GPIO_P0.03
NetP0_7: P0.7 ; port GPIO_P0.04
NetP1_3: P1.3 ; port GPIO_P1.00
NetP1_4: P1.4 ; port GPIO_P1.01
NetP1_5: P1.5 ; port GPIO_P1.02
NetP1_6: P1.6 ; port GPIO_P1.03
NetP1_7: P1.7 ; port GPIO_P1.04
NetP1_8: P1.8 ; port GPIO_P1.05
NetP1_9: P1.9 ; port GPIO_P1.06
NetP1_10: P1.10 ; port GPIO_P1.07
NetP1_11: P1.11 ; port GPIO_P1.08
NetP1_12: P1.12 ; port GPIO_P1.09
NetP1_13: P1.13 ; port GPIO_P1.10
NetP1_14: P1.14 ; port GPIO_P1.11
NetP1_15: P1.15 ; port GPIO_P1.12
NetP1_16: P1.16 ; port GPIO_P1.13
NetP1_17: P1.17 ; port GPIO_P1.14
NetP2_3: P2.3 ; port GPIO_P2.00
NetP2_4: P2.4 ; port GPIO_P2.01
NetP2_5: P2.5 ; port GPIO_P2.02
NetP2_6: P2.6 ; port GPIO_P2.03
NetP2_7: P2.7 ; port GPIO_P2.04
NetP2_8: P2.8 ; port GPIO_P2.05
NetP2_9: P2.9 ; port GPIO_P2.06
NetP2_10: P2.10 ; port GPIO_P2.07
NetP2_11: P2.11 ; port GPIO_P2.08
NetP2_12: P2.12 ; port GPIO_P2.09
NetP2_13: P2.13 ; port GPIO_P2.10
NetP15_2: P15.2 P16.2 ; port SWD_nRF54.SWDIO
NetP15_4: P15.4 P16.4 ; port SWD_nRF54.SWDCLK
NetP15_6: P15.6 P16.6 ; port SWD_nRF54.SWO
NetP15_10: P15.10 P16.10 ; port SWD_nRF54.RESET
NetP19_2: P19.2 ; port SWD0_EXT.SWDIO
NetP19_3: P19.3 ; port SWD0_EXT.SELECT
NetP19_4: P19.4 ; port SWD0_EXT.SWDCLK
NetP19_6: P19.6 ; port SWD0_EXT.SWO
NetP19_10: P19.10 ; port SWD0_EXT.RESET
NetR36_1: R36.1 SW4.4(N.O-2)
NetU11_6: U11.6(D+) ; port USB_DBGR.D+
NetU11_7: U11.7(D–) ; port USB_DBGR.D-

Not connected (* = marked no-connect by the designer): J3 A8(SBU1) B8(SBU2); J7 1 3 5; P0 8 9 10 11 12 13 14 15 16 17 18; P1 18; P2 14 15 16 17 18; P15 7 8; P16 7 8 11 13; P19 7 8 9; P30 3; P31 3; P32 3; SW4 1(N.O-1) 6(N.C-2); U11 4(ID)*

### Layout directives
differential pair; differential pair class IMCU; net class IMCU_USB: DBGR'_N, DBGR'_P

### Notes on the sheet
- Place on top of Trace connector
- Main Power ON/OFF
- Title
- Size
- Date:
- File:
- A3
- PCB Assembly Number
- Sheet
- Drawn By:
- Revision
- of
- Classification:
- (in symbol SD-80259-1021) B9; B4; B12; B1

### Library data of the parts
C30 = C0201-10n: Capacitor, X7R, ±10%; Manufacturer: N.A.; Part number IPS: 00000003480; Part number Norautron: 26621779; Part number NEMS: 100200067; Note: 10V; Pad Count: 2; Component Status: Active; Part Number: C0201-10n; Manufacturer Part Number: N.A.; LatestRevisionDate: 2017-11-09; Published: 2014-11-13; Value: 10nF; Artikkelnr Noca: N.A.; Footprint Doc: 0201; ComponentLink1URL: N.A.; ComponentLink1Description: Datasheet; ComponentLink2URL: N.A.; ComponentLink2Description: Supplier link; HelpURL: N.A.; Supplier 1: N.A.; Supplier Part Number 1: N.A.; Supplier 2: N.A.; Supplier Part Number 2: N.A.; Component Class: Capacitors; PartId: 100200067; Author: rsk
C46 C48 = C0201-100n: as C57 on sheet pca10156_sheet6_power_supply; Part Number: C0201-100n; Manufacturer Part Number: N.A.; LatestRevisionDate: 2017-11-09; Published: 2014-11-13; Value: 100nF; Artikkelnr Noca: N.A.; Footprint Doc: 0201; ComponentLink1URL: N.A.; ComponentLink1Description: Datasheet; ComponentLink2URL: N.A.; ComponentLink2Description: Supplier link; HelpURL: N.A.; Supplier 1: N.A.; Supplier Part Number 1: N.A.; Supplier 2: N.A.; Supplier Part Number 2: N.A.; Component Class: Capacitors; PartId: 100200078; Author: rsk
C47 = C0402-1µ0-16V-X5R: Capacitor, Ceramic, X5R, ±10%, 16V; Manufacturer: Murata; Manufacturer Part Number: GRT155R61C105KE01D; Part number NEMS: 100200452; Component Status: Active; Pad Count: 2; Artikkelnr Noca: N.A.; Part Number: C0402-1µ0-16V-X5R; PartId: 100200452; Component Class: Capacitors; Author: rsk; ComponentLink1URL: https://search.murata.co.jp/Ceramy/image/img/A01X/G101/ENG/GRT155R61C105KE01-01.pdf; ComponentLink1Description: Datasheet; ComponentLink2URL: https://www.murata.com/en-global/products/productdetail?partno=GRT155R61C105KE01%23; ComponentLink2Description: Supplier link; HelpURL: N.A.; LatestRevisionDate: 2020-12-15; Published: 2020-12-15; Footprint Doc: 0402; Value: 1.0µF; Note: 16V; Supplier 1: Digi-Key; Supplier Part Number 1: 490-12255-1-ND; Supplier 2: Mouser; Supplier Part Number 2: 81-GRT155R61C105KE1D; Part number IPS: N.A.; Part number Norautron: N.A.
C54 = C0603-4µ7-10V-X7S: as C58 on sheet pca10156_sheet6_power_supply; Part Number: C0603-4µ7-10V-X7S; Value: 4.7µF; Footprint Doc: 0603; Component Class: Capacitors; Author: rsk; PartId: 100200351; Manufacturer Part Number: N.A.; ComponentLink1URL: N.A.; ComponentLink1Description: Datasheet; ComponentLink2URL: N.A.; ComponentLink2Description: Supplier link; HelpURL: N.A.; LatestRevisionDate: 2016-08-15; Published: 2016-08-15; Note: 10V; Supplier 1: Digi-Key; Supplier Part Number 1: 445-14258-1-ND; Supplier 2: N.A.; Supplier Part Number 2: N.A.; Part number Norautron: N.A.
C59 = C0603-10n-100V-X7R: Capacitor, X7R, ±10%, 100V; Manufacturer: Murata; Manufacturer Part Number: GCM188R72A103KA37D; Part number NEMS: 100200349; Component Status: Active; Pad Count: 2; Artikkelnr Noca: N.A.; Part Number: C0603-10n-100V-X7R; PartId: 100200349; Component Class: Capacitors; Author: rsk; ComponentLink1URL: N.A.; ComponentLink1Description: Datasheet; ComponentLink2URL: N.A.; ComponentLink2Description: Supplier link; HelpURL: http://psearch.en.murata.com/capacitor/product/GCM188R72A103KA37%23.pdf; LatestRevisionDate: 2017-08-22; Published: 2017-08-22; Footprint Doc: 0603; Value: 10nF; Note: 100V; Supplier 1: Digi-Key; Supplier Part Number 1: 490-4781-1-ND; Supplier 2: N.A.; Supplier Part Number 2: N.A.; Part number IPS: N.A.; Part number Norautron: N.A.
FB2 = FB0402-120R@100M-500mA: as FB3 on sheet pca10156_sheet6_power_supply; Part Number: FB0402-120R@100M-500mA; Footprint Doc: 0402; LatestRevisionDate: 2014-01-10; Published: 2011-11-14; Value: 120R/0.55A; ComponentLink1Description: Datasheet; ComponentLink2Description: Supplier link; ComponentLink1URL: N.A.; ComponentLink2URL: N.A.; HelpURL: http://search.murata.co.jp/Ceramy/image/img/PDF/ENG/L0110S0100BLM15A_SN.pdf; Supplier 1: Digi-Key; Supplier Part Number 1: 490-1005-1-ND; Supplier 2: Farnell; Supplier Part Number 2: 151-5760; Component Class: Inductors; PartId: 100300099; Author: rsk
J3 = SD-80259-1021: USB-C Receptacle, 16 Pin, USB 2.0; Manufacturer: Bellweather Electronic Corp.; Part number NEMS: 100500830; Component Status: Active; Pad Count: 16; Note: N.A.; System: Connector; Part Number: SD-80259-1021; PartId: 100500830; Component Class: Connectors; Author: getr; Manufacturer Part Number: SD-80259-1021; ComponentLink1URL: \\hizz\pro\app9717\Datasheet\connectors\Bellwether\SD-80259-001_C.pdf; ComponentLink1Description: Datasheet; ComponentLink2URL: N.A.; ComponentLink2Description: Supplier link; HelpURL: N.A.; LatestRevisionDate: 2023-10-30; Published: 2023-10-30; Footprint Doc: SD-80259-001; Value: USB-C 2.0; Supplier 1: Cabcon; Supplier Part Number 1: SD-80259-1021; Supplier 2: N.A.; Supplier Part Number 2: N.A.; Artikkelnr Noca: N.A.; Part number IPS: N.A.; Part number Norautron: N.A.
J7 = FPC_05P-0.5mm-RA-SMD: 0.5mm FPC, 5P,Right Angle SMT,Double Contact,H=1.2mm,White, Tin plated; Manufacturer: WCON; Manufacturer Part Number: 5141-05RZDNWR03; Part number NEMS: 100500528; Note: (Replaced 5141-05RZDNWR02); Artikkelnr Noca: N.A.; Pad Count: 7; Component Status: Active; System: Connector; Part Number: FPC_05P-0.5mm-RA-SMD; Footprint Doc: FPC_05P-0.5mm-RA-SMD; LatestRevisionDate: 2024-02-02; Published: 2015-06-22; Value: FPC 0.5mm RA SMD; Part number IPS: N.A.; ComponentLink1URL: N.A.; ComponentLink1Description: Datasheet; ComponentLink2URL: N.A.; ComponentLink2Description: Supplier link; HelpURL: \\hizz\pro\app9717\Datasheet\connectors\W-CON\5141-05RZDNXX02.pdf; Supplier 1: Cabcon; Supplier Part Number 1: 5141-05RZDNWR03; Supplier 2: N.A.; Supplier Part Number 2: N.A.; Component Class: Connectors; PartId: 100500528; Author: rsk; Part number Norautron: N.A.
P0-P2 = Pin Header 2x10 SMD, 2.54mm: Pin Header 2x10, 2.54mm (100mil) SMD; Manufacturer: WCON; Manufacturer Part Number: 1125-1210S0M116CR09; Part number NEMS: 100500738; Pad Count: 20; Artikkelnr Noca: N.A.; Component Status: Active; System: Connector; Part Number: Pin Header 2x10 SMD, 2.54mm; Component Class: Connectors; Author: stl1; ComponentLink1URL: https://suddendocs.samtec.com/catalog_english/tsm.pdf; ComponentLink1Description: Datasheet; ComponentLink2URL: https://www.digikey.no/en/products/detail/samtec-inc/TSM-110-02-S-DV/6679037; ComponentLink2Description: Supplier link; HelpURL: https://www.samtec.com/products/tsm-110-02-s-dv; Footprint Doc: HDR_2x10-SMD-2.54MM; LatestRevisionDate: 2024-02-21; Published: 2022-01-24; Value: Pin Hdr 2x10; Note: SMD; Supplier 1: Cabcon; Supplier Part Number 1: 1125-1210S0M116CR09; Supplier 2: Samtec; Supplier Part Number 2: TSM-110-02-S-DV; Part number IPS: N.A.; Part number Norautron: N.A.; PartId: 100500738
P15 P19 = Pin Header 2x5 SMD, 1.27mm, KS: Pin Header 2x5, 1.27mm (50mil), SMD, Keying Shroud; Manufacturer: WCON; Manufacturer Part Number: 3132-10MS0BK00R5; Part number NEMS: 100500261; Note: (Replaced 3132-10MS0BK00R1); Artikkelnr Noca: N.A.; Pad Count: 10; Component Status: Active; System: Connector; Part Number: Pin Header 2x5 SMD, 1.27mm, KS; Footprint Doc: HDR_2x5-SMD-1.27mm; LatestRevisionDate: 2024-02-02; Published: 2016-01-22; Value: Pin Header 2x5, 1.27mm; Part number IPS: N.A.; ComponentLink1URL: N.A.; ComponentLink1Description: Datasheet; ComponentLink2URL: N.A.; ComponentLink2Description: Supplier link; HelpURL: \\hizz\pro\app9717\Datasheet\connectors\W-CON\3132-XXMXXBK00XX.pdf; Supplier 1: Cabcon; Supplier Part Number 1: 3132-10MS0BK00R5; Supplier 2: N.A.; Supplier Part Number 2: N.A.; Component Class: Connectors; PartId: 100500261; Author: rsk; Part number Norautron: N.A.
P16 = Pin Header 2x10 SMD, 1.27mm, KS, N.C.: Pin Header 2x10, 1.27mm (50mil), SMD, Keying Shroud; Manufacturer: WCON; Manufacturer Part Number: 3132-20MS0BK00R1; Part number NEMS: 100500279; Note: N.A.; Pad Count: 20; Component Status: Active; System: Connector; Part Number: Pin Header 2x10 SMD, 1.27mm, KS, N.C.; LatestRevisionDate: 2017-10-23; Published: 2017-09-07; Value: Pin Header 2x10, 1.27mm; Artikkelnr Noca: N.A.; Footprint Doc: HDR_2x10-SMD-1.27mm; Part number IPS: N.A.; ComponentLink1URL: N.A.; ComponentLink1Description: Datasheet; ComponentLink2URL: N.A.; ComponentLink2Description: Supplier link; HelpURL: N.A.; Supplier 1: Cabcon; Supplier Part Number 1: 3132-20MS0BK00R1; Supplier 2: Digi-Key; Supplier Part Number 2: FTSH-110-01-F-DV-K-ND; Component Class: Connectors; PartId: 100500279; Author: rsk; Part number Norautron: N.A.
P30-P32 = Pin Header 2x2 SMD: Pin Header 2x2, SMD, 2.54mm (100mil); Manufacturer: WCON; Manufacturer Part Number: 1125-1202S0M116CR03; Part number NEMS: 100500770; Component Status: Active; Pad Count: 4; Note: N.A.; System: Connector; Part Number: Pin Header 2x2 SMD; PartId: 100500770; Component Class: Connectors; Author: stl1; ComponentLink1URL: N.A.; ComponentLink1Description: Datasheet; ComponentLink2URL: N.A.; ComponentLink2Description: Supplier link; HelpURL: N.A.; LatestRevisionDate: 2024-02-21; Published: 2022-10-28; Footprint Doc: HDR_2x2-SMD; Value: Pin Header 2x2 SMD; Supplier 1: Cabcon; Supplier Part Number 1: 1125-1202S0M116CR03; Supplier 2: Samtec; Supplier Part Number 2: TSM-102-02-S-DV; Artikkelnr Noca: N.A.; Part number IPS: N.A.; Part number Norautron: N.A.
R36 = R0201-1k0: Resistor, ±1%, 0.05W; Manufacturer: N.A.; Part number IPS: 00000005786; Part number NEMS: 100100043; Component Status: Active; Pad Count: 2; Note: Chip Res 1%; Part Number: R0201-1k0; PartId: 100100043; Component Class: Resistors; Author: rsk; Manufacturer Part Number: N.A.; ComponentLink1URL: N.A.; ComponentLink1Description: Datasheet; ComponentLink2URL: N.A.; ComponentLink2Description: Supplier link; HelpURL: N.A.; LatestRevisionDate: 2014-11-13; Published: 2014-11-13; Footprint Doc: 0201; Value: 1k; Supplier 1: N.A.; Supplier Part Number 1: N.A.; Supplier 2: N.A.; Supplier Part Number 2: N.A.; Artikkelnr Noca: N.A.; Part number Norautron: N.A.
SW4 = MK-22D14-G2: Slide Switch DPDT; Manufacturer: HUA-JIE CORP.; Part number NEMS: 101500131; Note: N.A.; Pad Count: 6; Component Status: Active; Part Number: MK-22D14-G2; Manufacturer Part Number: MK-22D14-G2; Footprint Doc: MK-22D14-G2; LatestRevisionDate: 2020-10-06; Published: 2020-12-01; Value: MK-22D14-G2; Artikkelnr Noca: N.A.; Part number IPS: N.A.; ComponentLink1URL: N.A.; ComponentLink1Description: Datasheet; ComponentLink2URL: N.A.; ComponentLink2Description: Supplier link; HelpURL: N.A.; Supplier 1: Cabcon; Supplier Part Number 1: MK-22D14-G2; Supplier 2: N.A.; Supplier Part Number 2: N.A.; Component Class: Switches; PartId: 101500131; Author: rsk; Part number Norautron: N.A.
TP16-TP18 = TP_SMD_Ø1.5MM: as TP8 on sheet pca10156_sheet6_power_supply; Part Number: TP_SMD_Ø1.5MM; LatestRevisionDate: 2021-03-05; Published: 2016-06-02; Value: Ø1.5mm,SMD; Note: N.A.; Artikkelnr Noca: N.A.; Footprint Doc: TP_SMD_Ø1.5mm; Part number IPS: N.A.; ComponentLink1URL: N.A.; ComponentLink1Description: Datasheet; ComponentLink2URL: N.A.; ComponentLink2Description: Supplier link; HelpURL: N.A.; Supplier 1: N.A.; Supplier Part Number 1: N.A.; Supplier 2: N.A.; Supplier Part Number 2: N.A.; Component Class: Connectors; PartId: 100500477; Author: rsk; Part number Norautron: N.A.
TP22 = TP - S1751-46R: PC TEST POINT TIN SMD L; Manufacturer: Harwin; Part number NEMS: 100500525; Component Status: Active; Pad Count: 1; Note: N.A.; Part Number: TP - S1751-46R; PartId: 100500525; Component Class: Connectors; Author: rsk; Manufacturer Part Number: S1751-46R; ComponentLink1URL: N.A.; ComponentLink1Description: Datasheet; ComponentLink2URL: N.A.; ComponentLink2Description: Supplier link; HelpURL: http://cdn.harwin.com/pdfs/S1751.pdf; LatestRevisionDate: 2015-05-29; Published: 2015-05-29; Footprint Doc: Harwin S1751-46R; Value: TP; Supplier 1: Digi-Key; Supplier Part Number 1: 952-1478-1-ND; Supplier 2: N.A.; Supplier Part Number 2: N.A.; Artikkelnr Noca: N.A.; Part number IPS: N.A.; Part number Norautron: N.A.
U11 = ECMF02-4CMX8: 2 Line Common mode filter with ESD protection for USB 2.0 interface; Manufacturer: STMicroelectronics; Part number NEMS: 100800034; Component Status: Active; Pad Count: 8; Note: N.A.; Part Number: ECMF02-4CMX8; PartId: 100800034; Component Class: Filters; Author: eisk; Manufacturer Part Number: ECMF02-4CMX8; ComponentLink1URL: https://www.st.com/content/ccc/resource/technical/document/datasheet/group3/1c/93/cf/72/85/cf/4d/d6/DM00039389/files/DM00039389.pdf/jcr:content/translations/en.DM00039389.pdf; ComponentLink1Description: Datasheet; ComponentLink2URL: https://www.digikey.com/en/products/detail/stmicroelectronics/ECMF02-4CMX8/3770020; ComponentLink2Description: Supplier link; HelpURL: https://www.st.com/content/ccc/resource/technical/document/datasheet/group3/1c/93/cf/72/85/cf/4d/d6/DM00039389/files/DM00039389.pdf/jcr:content/translations/en.DM00039389.pdf; LatestRevisionDate: 2024-01-31; Published: 2024-01-31; Footprint Doc: UFDFN-8; Value: ECMF02-4CMX8; Supplier 1: Digi-Key; Supplier Part Number 1: 497-13420-2-ND; Supplier 2: Mouser; Supplier Part Number 2: 511-ECMF02-4CMX8; Artikkelnr Noca: N.A.; Part number IPS: N.A.; Part number Norautron: N.A.

## Nets that join several sheets
GND: pca10156_sheet6_power_supply (20 pins), pca10156_sheet7_connectors (34 pins)
VBUS: pca10156_sheet6_power_supply (6 pins), pca10156_sheet7_connectors (6 pins)
VDDIO: pca10156_sheet6_power_supply (5 pins), pca10156_sheet7_connectors (8 pins)
NetJ3_A5: pca10156_sheet6_power_supply (U10.23), pca10156_sheet7_connectors (J3.A5)
NetJ3_B5: pca10156_sheet6_power_supply (U10.24), pca10156_sheet7_connectors (J3.B5)

## Assembly variants
Release: not fitted C41 C50 C51 C56 C59 P4 P16 R24 R29 R30 R33 R34 R54